# EAGLE design cociclo_placeCommune (EAGLE 7.2.0)
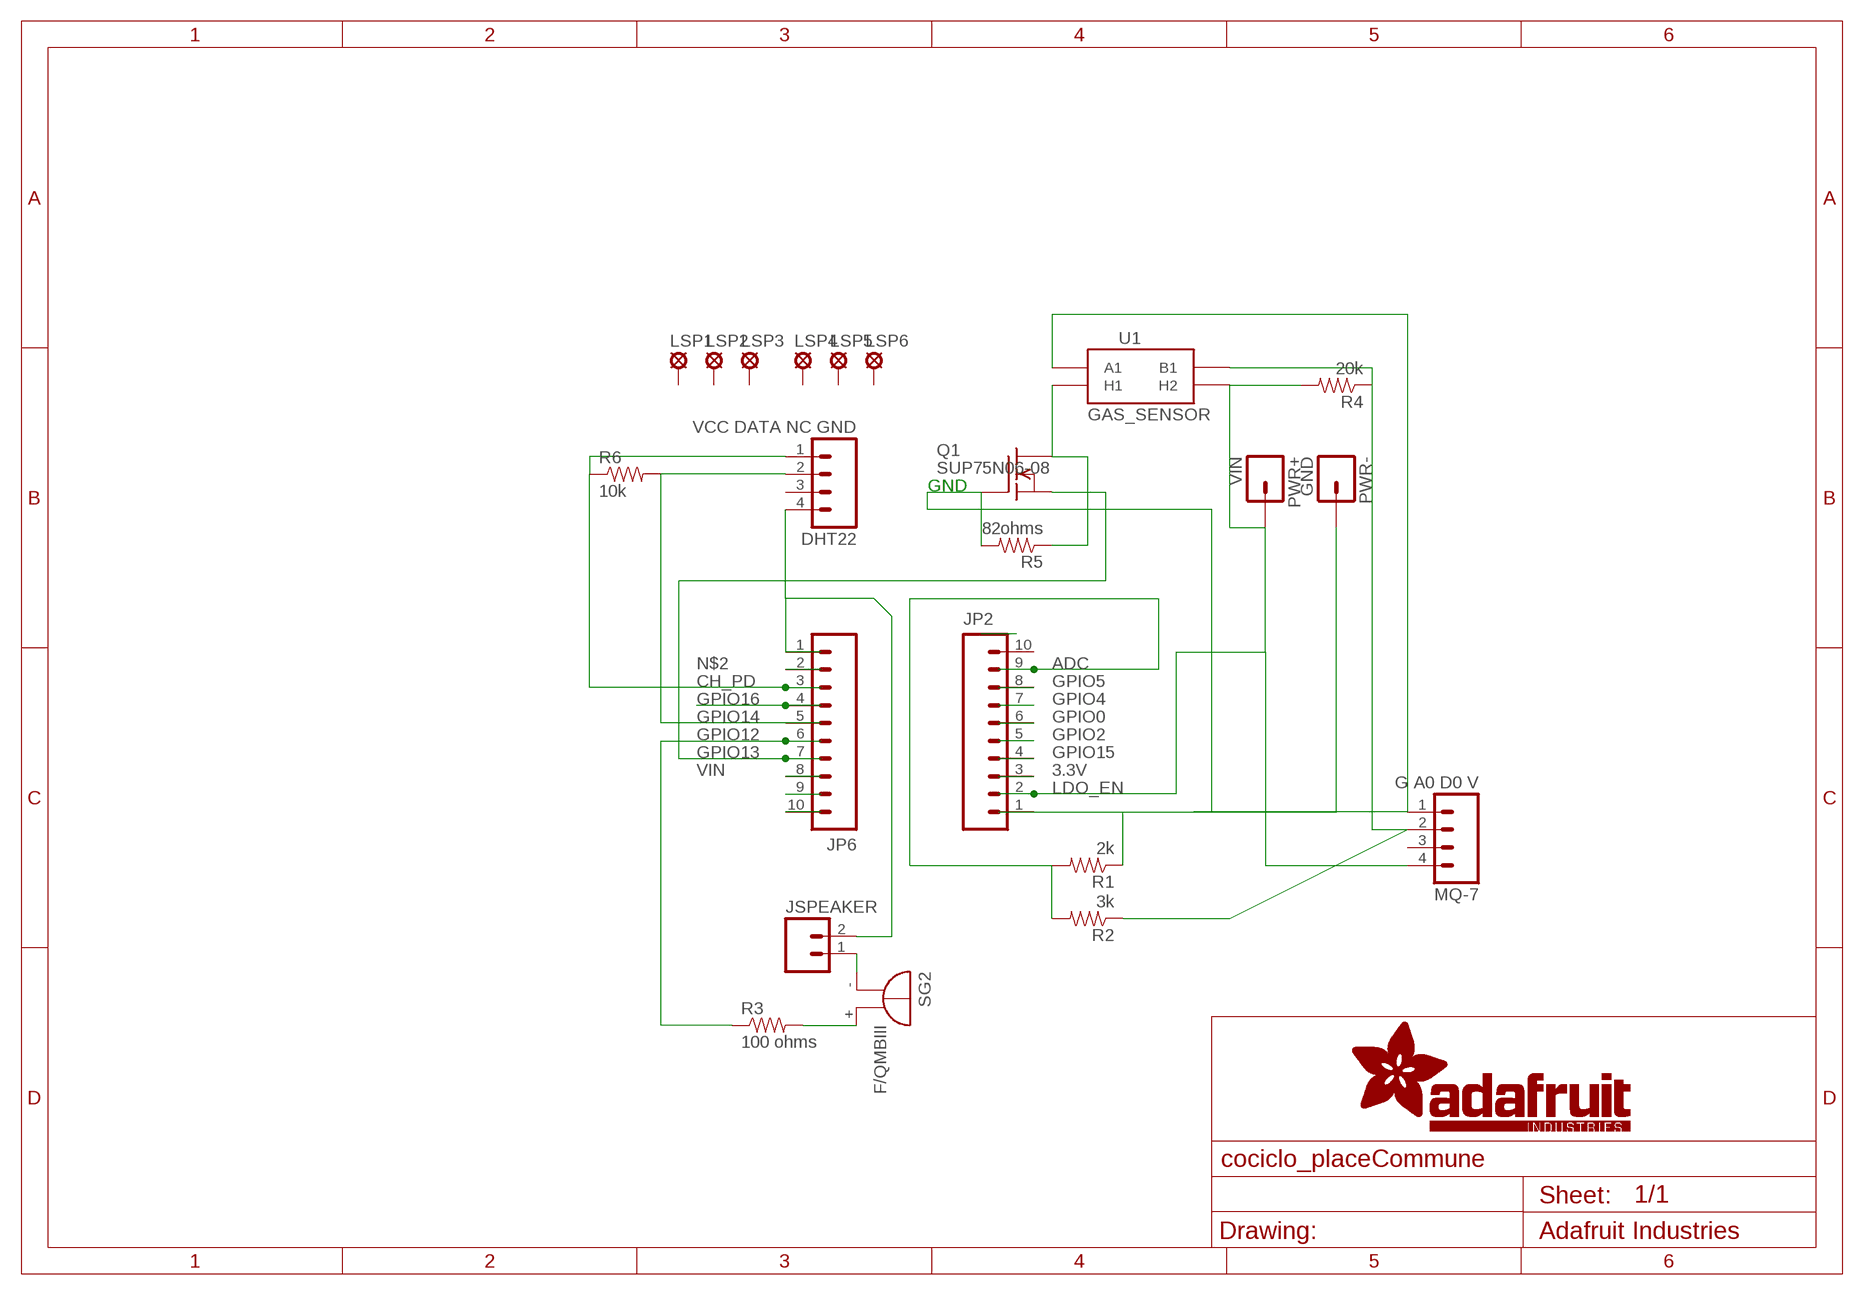
[diagram p0: schematic, sheet 1]

## Parts
DHT22  VCC DATA NC GND  M04PTH  [1X04]
JP2  M10SILK_FEMALE_PTH  [1X10]
JP6  M10SILK_FEMALE_PTH  [1X10]
JSPEAKER  M02PTH  [1X02]
LSP1  LSP10  [LSP10]
LSP2  LSP10  [LSP10]
LSP3  LSP10  [LSP10]
LSP4  LSP10  [LSP10]
LSP5  LSP10  [LSP10]
LSP6  LSP10  [LSP10]
MQ-7  G A0 D0 V  M04PTH  [1X04]
PWR+  VIN  M01NOSILK-KIT  [1X01NS-KIT]
PWR-  GND  M01NOSILK-KIT  [1X01NS-KIT]
Q1  SUP75N06-08  [TO220]
R1  2k  RESISTOR1206  [1206]
R2  3k  RESISTOR1206  [1206]
R3  100 ohms  RESISTOR1206  [1206]
R4  20k  RESISTOR1206  [1206]
R5  82ohms  RESISTOR1206  [1206]
R6  10k  RESISTOR1206  [1206]
SG2  F/QMBIII  [F/QMBIII]
U1  GAS_SENSOR  [MQ-3]

## Nets
3.3V: JP2.3
ADC: JP2.9 R1.2 R2.2
CH_PD: DHT22.1 JP6.3 R6.1
GND: JP2.1 JP6.10 MQ-7.1 PWR-.1 Q1.1(G) R1.1 R5.2 U1.A1
GPIO0: JP2.6
GPIO2: JP2.5
GPIO4: JP2.7
GPIO5: JP2.8
GPIO12: JP6.6 R3.1
GPIO13: JP6.7 Q1.3(S)
GPIO14: DHT22.2 JP6.5 R6.2
GPIO15: JP2.4
GPIO16: JP6.4
LDO_EN: JP2.2 MQ-7.4 PWR+.1 R4.2 U1.HB(H2)
N$2: JP6.2
N$3: MQ-7.2 R2.1 R4.1 U1.B1
N$4: R3.2 SG2.+(-)
N$5: JSPEAKER.1 SG2.-(+)
N$8: Q1.2(D) R5.1 U1.HA(H1)
RESET_5V: DHT22.4 JP6.1 JSPEAKER.2
VBAT: JP6.9
VIN: JP6.8
Unconnected: DHT22.3 JP2.10 LSP1.MP LSP2.MP LSP3.MP LSP4.MP LSP5.MP LSP6.MP MQ-7.3

## Notes on the sheet
- GND

## Library data of the parts
DHT22 MQ-7 = SparkFun-Connectors:M04: Header 4 Standard 4-pin 0.1" header. Use with straight break away headers (SKU : PRT-00116), right angle break away headers (PRT-00553), swiss pins (PRT-00743), machine pins (PRT-00117), and female headers (PRT-00115). Molex polarized connector foot print use with SKU : PRT-08231 with associated crimp pins and housings. 1MM SMD Version SKU: PRT-10208
JP2 JP6 = SparkFun-Connectors:M10: Header 10 Standard 10-pin 0.1" header. Use with straight break away headers (SKU : PRT-00116), right angle break away headers (PRT-00553), swiss pins (PRT-00743), machine pins (PRT-00117), and female headers (PRT-00115).; PROD_ID: CONN-11563
JSPEAKER = SparkFun-Connectors:M02: Standard 2-pin 0.1" header. Use with - straight break away headers ( PRT-00116) - right angle break away headers (PRT-00553) - swiss pins (PRT-00743) - machine pins (PRT-00117) - female headers (PRT-00115) Molex polarized connector foot print use with: PRT-08233 with associated crimp pins and housings. 2.54_SCREWTERM for use with PRT-10571. 3.5mm Screw Terminal footprints for PRT-08084 5mm Screw Terminal footprints for use with PRT-08432
LSP1-LSP6 = solpad:LSP10: SOLDER PAD drill 1.0 mm, distributor Buerklin, 12H555
PWR+ PWR- = SparkFun-Connectors:M01: Header 1 Standard 1-pin 0.1" header. Use with straight break away headers (SKU : PRT-00116), right angle break away headers (PRT-00553), swiss pins (PRT-00743), machine pins (PRT-00117), and female headers (PRT-00115).
Q1 = transistor-fet:SUP75N06-08: N-Channel Enhancement MOSFET 60V; 75A; 0,008Ohm
R1-R6 = SparkFun-Resistors:RESISTOR: Resistor Basic schematic elements and footprints for 0603, 1206, and PTH resistors.
SG2 = buzzer:F/QMBIII: BUZZER Source: Buerklin; OC_FARNELL: unknown; OC_NEWARK: unknown
U1 = SparkFun-Sensors:GAS_SENSOR: MQ-3 alcohol gas sensor . FP not tested. SEN-08880.

## Board
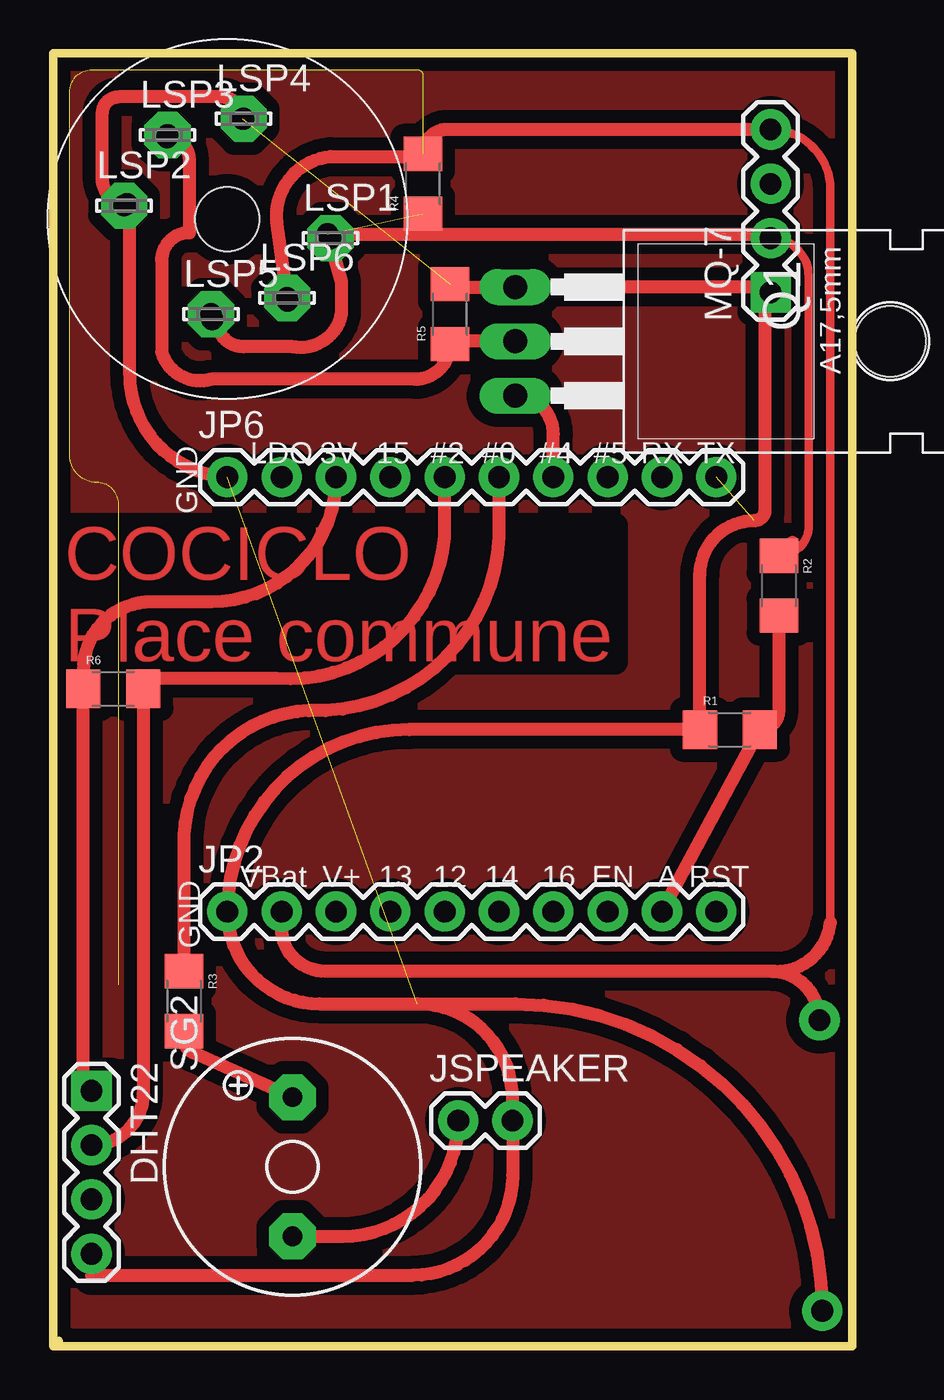
[diagram p1: board, top side]
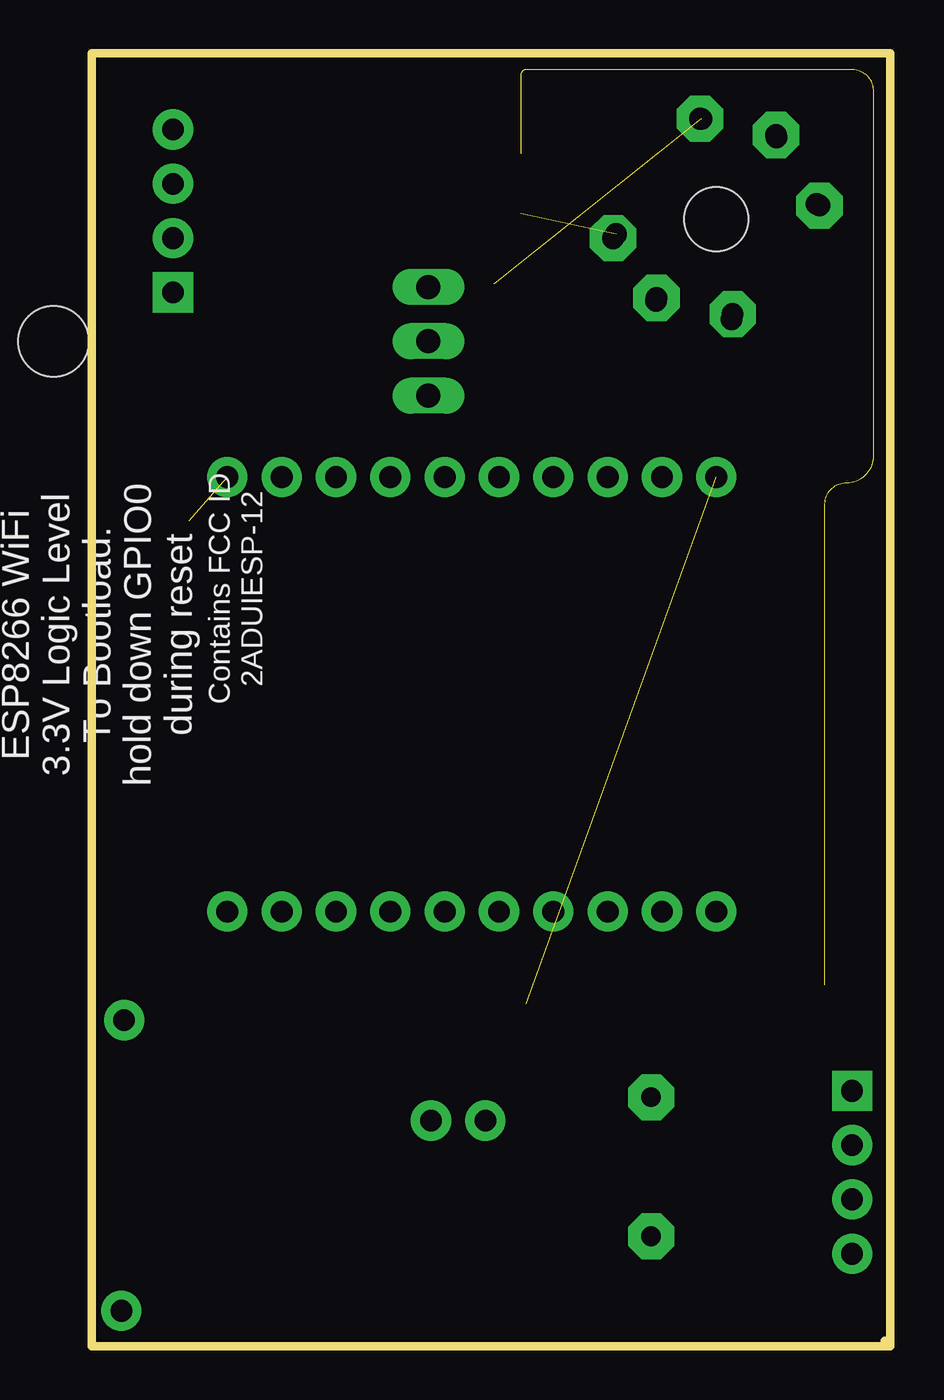
[diagram p2: board, bottom side, seen from below]

Size 37.34 x 60.45 mm. Coordinates in mm from the lower left corner, seen from the top.
Outline: 0,0.25 0,60.45 37.34,60.45 37.34,0 0,0 0,0.25
Outline: 0,0.25 0.25,0.25
Copper layers (1*16): Top 0.035mm / dielectric 1.5mm / Bottom 0.035mm
Design rules "adafruit *": minimum track width 10mil, minimum drill 15.5mil, track to track 8mil, track to pad 8mil, pad to pad 8mil, via to via 8mil, smd to smd 8mil, copper to edge 10mil, drill to drill 8mil, minimum pad ring 10mil, minimum via ring 8mil, stop-mask expansion 2mil, vias tented up to drill 20mil, thermal gap 10mil

### Footprints (pad centres in the part's own frame; a part is rotated, then mirrored left to right if it is on the bottom)
1X04 = drill 1.016 pad 1.88 square: 1 0,0 | drill 1.016 pad 1.88: 2 2.54,0; 3 5.08,0; 4 7.62,0
1X10 = drill 1.016 pad 1.88: 1 0,0; 2 2.54,0; 3 5.08,0; 4 7.62,0; 5 10.16,0; 6 12.7,0; 7 15.24,0; 8 17.78,0; 9 20.32,0; 10 22.86,0
1X02 = drill 1.016 pad 1.88: 1 0,0; 2 2.54,0
LSP10 = drill 1.016 pad 2.159 octagon: MP 0,0
1X01NS-KIT = drill 1.016 pad 1.88: 1 0,0
TO220 = drill 1.118 long: 1 -2.54,-6.35; 2 0,-6.35; 3 2.54,-6.35 | hole 3.302: 0,11.176
1206 = smd 1.6 x 1.8: 1 -1.4,0; 2 1.4,0
F/QMBIII = drill 0.914 pad 2.159 octagon: + 3.251,0; - -3.251,0
MQ-3 = drill 1.016: A1 -3.35,3.35; A2 -3.35,-3.35; B1 3.35,3.35; B2 3.35,-3.35; HA -4.75,0; HB 4.75,0 | hole 3: 0,0

### Placement (x,y rotation side)
DHT22  1.78,11.94 270 top
JP2  8.13,20.32 0 top
JP6  8.13,40.64 0 top
JSPEAKER  18.92,10.54 0 top
LSP1  12.95,51.82 0 top
LSP2  3.3,53.34 0 top
LSP3  5.33,56.64 0 top
LSP4  8.89,57.4 0 top
LSP5  7.37,48.26 0 top
LSP6  10.92,49.02 0 top
MQ-7  33.53,49.28 90 top
PWR+  35.81,15.24 0 top
PWR-  35.94,1.65 180 top
Q1  27.94,46.99 270 top
R1  31.62,28.83 0 top
R2  33.91,35.56 270 top
R3  6.1,16.13 270 top
R4  17.27,54.36 90 top
R5  18.54,48.26 90 top
R6  2.79,30.73 0 top
SG2  11.18,8.38 90 top
U1  8.13,52.71 306.4 top
U$2  [HUZZAHLOGO]  20.57,30.35 0 bottom

### Tracks (layer width: path | path; a pad name or v marks a point on that pad's centre or on a via)
ADC
  Top 0.61: JP2.9 R1.2 arc90 33.91,29.71 R2.2
CH_PD
  Top 0.61: DHT22.1 arc-90 1.39,12.32 R6.1 1.39,31.62 arc-90 4.57,34.8 7.37,34.8 arc90 JP6.3
COPPER
  pour Top (isolate 0.61): 37.34,0 37.34,60.45 0,60.45 0,0
GND  (2 unrouted)
  Top 0.61: PWR-.1 arc90 21.59,16 12.45,16 arc-90 JP2.1 arc-90 16.64,28.83 R1.1 30.22,36.07 arc-90 32.77,38.61 arc90 33.27,39.12 33.27,49.02 arc-90 MQ-7.1 arc-90 33.78,49.53 33.78,49.02 33.27,49.53 Q1.1 19.05,49.53 arc-90 18.8,49.78 18.67,49.78 arc90 R5.2 | 8.38,40.64 arc-90 3.56,45.47 3.56,53.34 arc-90 2.29,54.61 2.29,57.66 arc-90 3.05,58.42 7.81,58.42 arc-90 U1.A1
GPIO12
  Top 0.61: JP6.6 20.83,37.85 arc-90 11.94,29.72 arc90 6.1,23.37 R3.1
GPIO13
  Top 0.61: JP6.7 23.37,42.67 arc90 Q1.3
GPIO14
  Top 0.61: DHT22.2 arc90 4.19,11.81 R6.2 arc-90 4.7,31.24 10.41,31.24 arc90 18.29,37.85 JP6.5
LDO_EN  (8 unrouted)
  Top 0.406: MQ-7.4 arc-90 36.32,54.1 36.32,19.81
  Top 0.61: PWR+.1 arc90 33.53,17.53 | 33.53,17.53 12.7,17.53 arc-90 10.67,19.56 JP2.2 | 33.53,17.53 arc90 36.32,19.81 | MQ-7.4 18.41,56.9 arc90 R4.2 arc-90 17.14,55.63 12.95,55.63 arc90 10.44,52.6 U1.HB
  Bottom 0.406: PWR+.1 36.32,15.24
N$3  (1 unrouted)
  Top 0.406: MQ-7.2 arc-90 35.31,50.04 35.31,38.36 arc-90 R2.1
  Top 0.61: MQ-7.2 arc90 33.09,52 U1.B1 13.46,49.78 13.46,48.26 arc-90 11.18,46.74 8.89,46.74 arc-90 7.62,48.01 | 34.54,37.59 arc-90 R2.1
N$4
  Top 0.61: SG2.+ 6.65,13.67 arc-90 R3.2
N$5
  Top 0.61: SG2.- 13.51,5.13 arc90 JSPEAKER.1
N$8
  Top 0.61: Q1.2 18.67,46.99 arc90 R5.1 arc-90 16.89,45.21 7.37,45.21 arc-90 5.05,46.51 5.05,50.78 arc-90 6.35,52.07 6.35,55.49 arc90 U1.HA
RESET_5V  (1 unrouted)
  Top 0.61: 17.02,16 arc-90 21.46,11.56 JSPEAKER.2 21.46,8 arc-90 16.76,3.3 1.78,3.3 DHT22.4

### Text on the board
Top: COCICLO / Place commune
tPlace: LDO | 3V | 15 | #2 | #0 | #4 | #5 | RX | TX | GND | VBat | V+ | 13 | 12 | 14 | 16 | EN | A | RST | GND
bPlace: Contains FCC ID / 2ADUIESP-12 | ESP8266 WiFi / 3.3V Logic Level / To Bootload: / hold down GPIO0 / during reset